# Altium schematic sheet CellVoltageControl.SchDoc
size A4; SheetNumber: 5; SheetTotal: 8
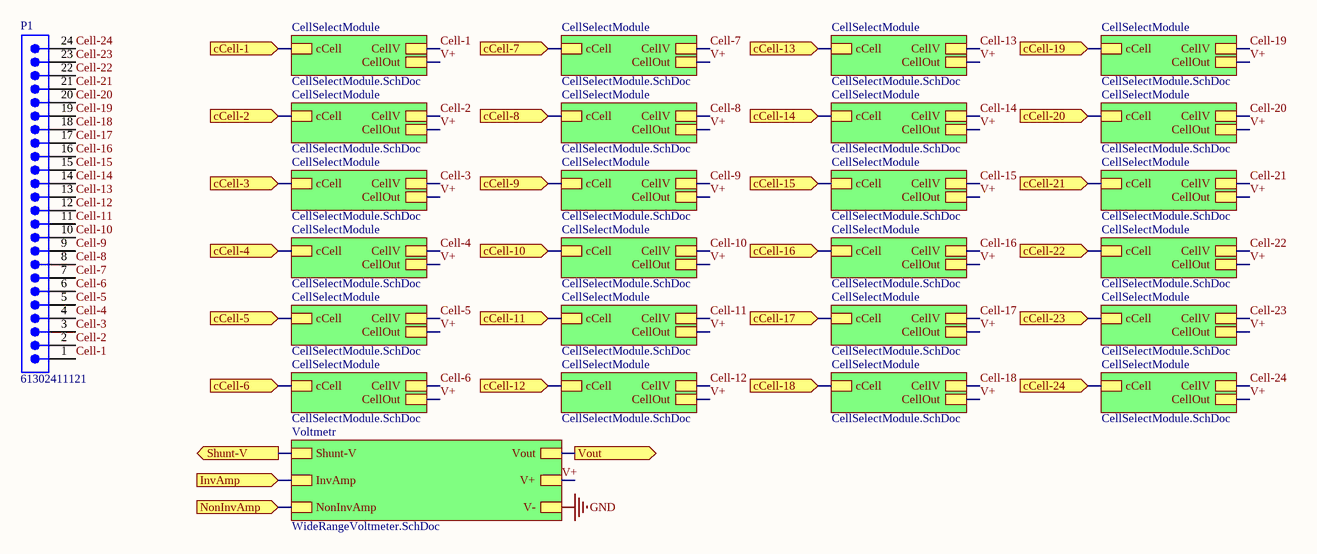
[diagram p0: CellVoltageControl.SchDoc]

## Parts
P1  61302411121  [61302411121]

## Sub-sheets
CellSelectModule = CellSelectModule.SchDoc: cCell, CellV, CellOut
CellSelectModule = CellSelectModule.SchDoc: cCell, CellV, CellOut
CellSelectModule = CellSelectModule.SchDoc: cCell, CellV, CellOut
CellSelectModule = CellSelectModule.SchDoc: cCell, CellV, CellOut
CellSelectModule = CellSelectModule.SchDoc: cCell, CellV, CellOut
CellSelectModule = CellSelectModule.SchDoc: cCell, CellV, CellOut
CellSelectModule = CellSelectModule.SchDoc: cCell, CellV, CellOut
CellSelectModule = CellSelectModule.SchDoc: cCell, CellV, CellOut
CellSelectModule = CellSelectModule.SchDoc: cCell, CellV, CellOut
CellSelectModule = CellSelectModule.SchDoc: cCell, CellV, CellOut
CellSelectModule = CellSelectModule.SchDoc: cCell, CellV, CellOut
CellSelectModule = CellSelectModule.SchDoc: cCell, CellV, CellOut
CellSelectModule = CellSelectModule.SchDoc: cCell, CellV, CellOut
CellSelectModule = CellSelectModule.SchDoc: cCell, CellV, CellOut
CellSelectModule = CellSelectModule.SchDoc: cCell, CellV, CellOut
CellSelectModule = CellSelectModule.SchDoc: cCell, CellV, CellOut
CellSelectModule = CellSelectModule.SchDoc: cCell, CellV, CellOut
CellSelectModule = CellSelectModule.SchDoc: cCell, CellV, CellOut
CellSelectModule = CellSelectModule.SchDoc: cCell, CellV, CellOut
CellSelectModule = CellSelectModule.SchDoc: cCell, CellV, CellOut
CellSelectModule = CellSelectModule.SchDoc: cCell, CellV, CellOut
CellSelectModule = CellSelectModule.SchDoc: cCell, CellV, CellOut
CellSelectModule = CellSelectModule.SchDoc: cCell, CellV, CellOut
CellSelectModule = CellSelectModule.SchDoc: cCell, CellV, CellOut
Voltmetr = WideRangeVoltmeter.SchDoc: InvAmp, NonInvAmp, V-, V+, Shunt-V, Vout

## Ports
cCell-1 (in, see MainBoard[3A]), cCell-2 (in, see MainBoard[3A]), cCell-3 (in, see MainBoard[3A]), cCell-4 (in, see MainBoard[3A]), cCell-5 (in, see MainBoard[3A]), cCell-6 (in, see MainBoard[3A]), cCell-7 (in, see MainBoard[3A]), cCell-8 (in, see MainBoard[3A]), cCell-9 (in, see MainBoard[3A]), cCell-10 (in, see MainBoard[3A]), cCell-11 (in, see MainBoard[3A]), cCell-12 (in, see MainBoard[3A]), cCell-13 (in, see MainBoard[4A]), cCell-14 (in, see MainBoard[4A]), cCell-15 (in, see MainBoard[4A]), cCell-16 (in, see MainBoard[4A]), cCell-17 (in, see MainBoard[4A]), cCell-18 (in, see MainBoard[4A]), cCell-19 (in, see MainBoard[4A]), cCell-20 (in, see MainBoard[4A]), cCell-21 (in, see MainBoard[4A]), cCell-22 (in, see MainBoard[4A]), cCell-23 (in, see MainBoard[4A]), cCell-24 (in, see MainBoard[4A]), InvAmp (in, see MainBoard[3A], WideRangeVoltmeter[1A]), NonInvAmp (in, see MainBoard[3A], WideRangeVoltmeter[1A]), Shunt-V (out, see MainBoard[3A]), Vout (out, see MainBoard[4A], WideRangeVoltmeter[4A])

## Nets
GND: sheet Voltmetr/V-
cCell-1: port cCell-1, sheet CellSelectModule/cCell
cCell-2: port cCell-2, sheet CellSelectModule/cCell
cCell-3: port cCell-3, sheet CellSelectModule/cCell
cCell-4: port cCell-4, sheet CellSelectModule/cCell
cCell-5: port cCell-5, sheet CellSelectModule/cCell
cCell-6: port cCell-6, sheet CellSelectModule/cCell
cCell-7: port cCell-7, sheet CellSelectModule/cCell
cCell-8: port cCell-8, sheet CellSelectModule/cCell
cCell-9: port cCell-9, sheet CellSelectModule/cCell
cCell-10: port cCell-10, sheet CellSelectModule/cCell
cCell-11: port cCell-11, sheet CellSelectModule/cCell
cCell-12: port cCell-12, sheet CellSelectModule/cCell
cCell-13: port cCell-13, sheet CellSelectModule/cCell
cCell-14: port cCell-14, sheet CellSelectModule/cCell
cCell-15: port cCell-15, sheet CellSelectModule/cCell
cCell-16: port cCell-16, sheet CellSelectModule/cCell
cCell-17: port cCell-17, sheet CellSelectModule/cCell
cCell-18: port cCell-18, sheet CellSelectModule/cCell
cCell-19: port cCell-19, sheet CellSelectModule/cCell
cCell-20: port cCell-20, sheet CellSelectModule/cCell
cCell-21: port cCell-21, sheet CellSelectModule/cCell
cCell-22: port cCell-22, sheet CellSelectModule/cCell
cCell-23: port cCell-23, sheet CellSelectModule/cCell
cCell-24: port cCell-24, sheet CellSelectModule/cCell
Cell-1: P1.1 ; sheet CellSelectModule/CellV
Cell-2: P1.2 ; sheet CellSelectModule/CellV
Cell-3: P1.3 ; sheet CellSelectModule/CellV
Cell-4: P1.4 ; sheet CellSelectModule/CellV
Cell-5: P1.5 ; sheet CellSelectModule/CellV
Cell-6: P1.6 ; sheet CellSelectModule/CellV
Cell-7: P1.7 ; sheet CellSelectModule/CellV
Cell-8: P1.8 ; sheet CellSelectModule/CellV
Cell-9: P1.9 ; sheet CellSelectModule/CellV
Cell-10: P1.10 ; sheet CellSelectModule/CellV
Cell-11: P1.11 ; sheet CellSelectModule/CellV
Cell-12: P1.12 ; sheet CellSelectModule/CellV
Cell-13: P1.13 ; sheet CellSelectModule/CellV
Cell-14: P1.14 ; sheet CellSelectModule/CellV
Cell-15: P1.15 ; sheet CellSelectModule/CellV
Cell-16: P1.16 ; sheet CellSelectModule/CellV
Cell-17: P1.17 ; sheet CellSelectModule/CellV
Cell-18: P1.18 ; sheet CellSelectModule/CellV
Cell-19: P1.19 ; sheet CellSelectModule/CellV
Cell-20: P1.20 ; sheet CellSelectModule/CellV
Cell-21: P1.21 ; sheet CellSelectModule/CellV
Cell-22: P1.22 ; sheet CellSelectModule/CellV
Cell-23: P1.23 ; sheet CellSelectModule/CellV
Cell-24: P1.24 ; sheet CellSelectModule/CellV
InvAmp: port InvAmp, sheet Voltmetr/InvAmp
NonInvAmp: port NonInvAmp, sheet Voltmetr/NonInvAmp
Shunt-V: port Shunt-V, sheet Voltmetr/Shunt-V
V+: sheet Voltmetr/V+, sheet CellSelectModule/CellOut, sheet CellSelectModule/CellOut, sheet CellSelectModule/CellOut, sheet CellSelectModule/CellOut, sheet CellSelectModule/CellOut, sheet CellSelectModule/CellOut, sheet CellSelectModule/CellOut, sheet CellSelectModule/CellOut, sheet CellSelectModule/CellOut, sheet CellSelectModule/CellOut, sheet CellSelectModule/CellOut, sheet CellSelectModule/CellOut, sheet CellSelectModule/CellOut, sheet CellSelectModule/CellOut, sheet CellSelectModule/CellOut, sheet CellSelectModule/CellOut, sheet CellSelectModule/CellOut, sheet CellSelectModule/CellOut, sheet CellSelectModule/CellOut, sheet CellSelectModule/CellOut, sheet CellSelectModule/CellOut, sheet CellSelectModule/CellOut, sheet CellSelectModule/CellOut, sheet CellSelectModule/CellOut
Vout: port Vout, sheet Voltmetr/Vout

## Library data of the parts
P1 = CMP-1502-01109-3: NexarPartId: 32855561; Pitch: 2.54mm; Contact Resistance: 20mΩ; Operating Supply Voltage: 250V; Current Rating: 3A; Gender: Male; Connector Type: Male Pin; Number of Positions: 24; Packaging: Bulk; Lead Pitch: 2.54mm; Number of Pins: 24; Orientation: Vertical; Contact Material: Copper; REACH SVHC: Unknown; Color: Black; Mount: Through Hole; Contact Plating: Gold; Contact Mating Length: 5.9944mm; RoHS: Compliant; Termination: Solder; Number of Rows: 1; Number of Contacts: 24